# Altium schematic sheet Sheet1.SchDoc
size A4
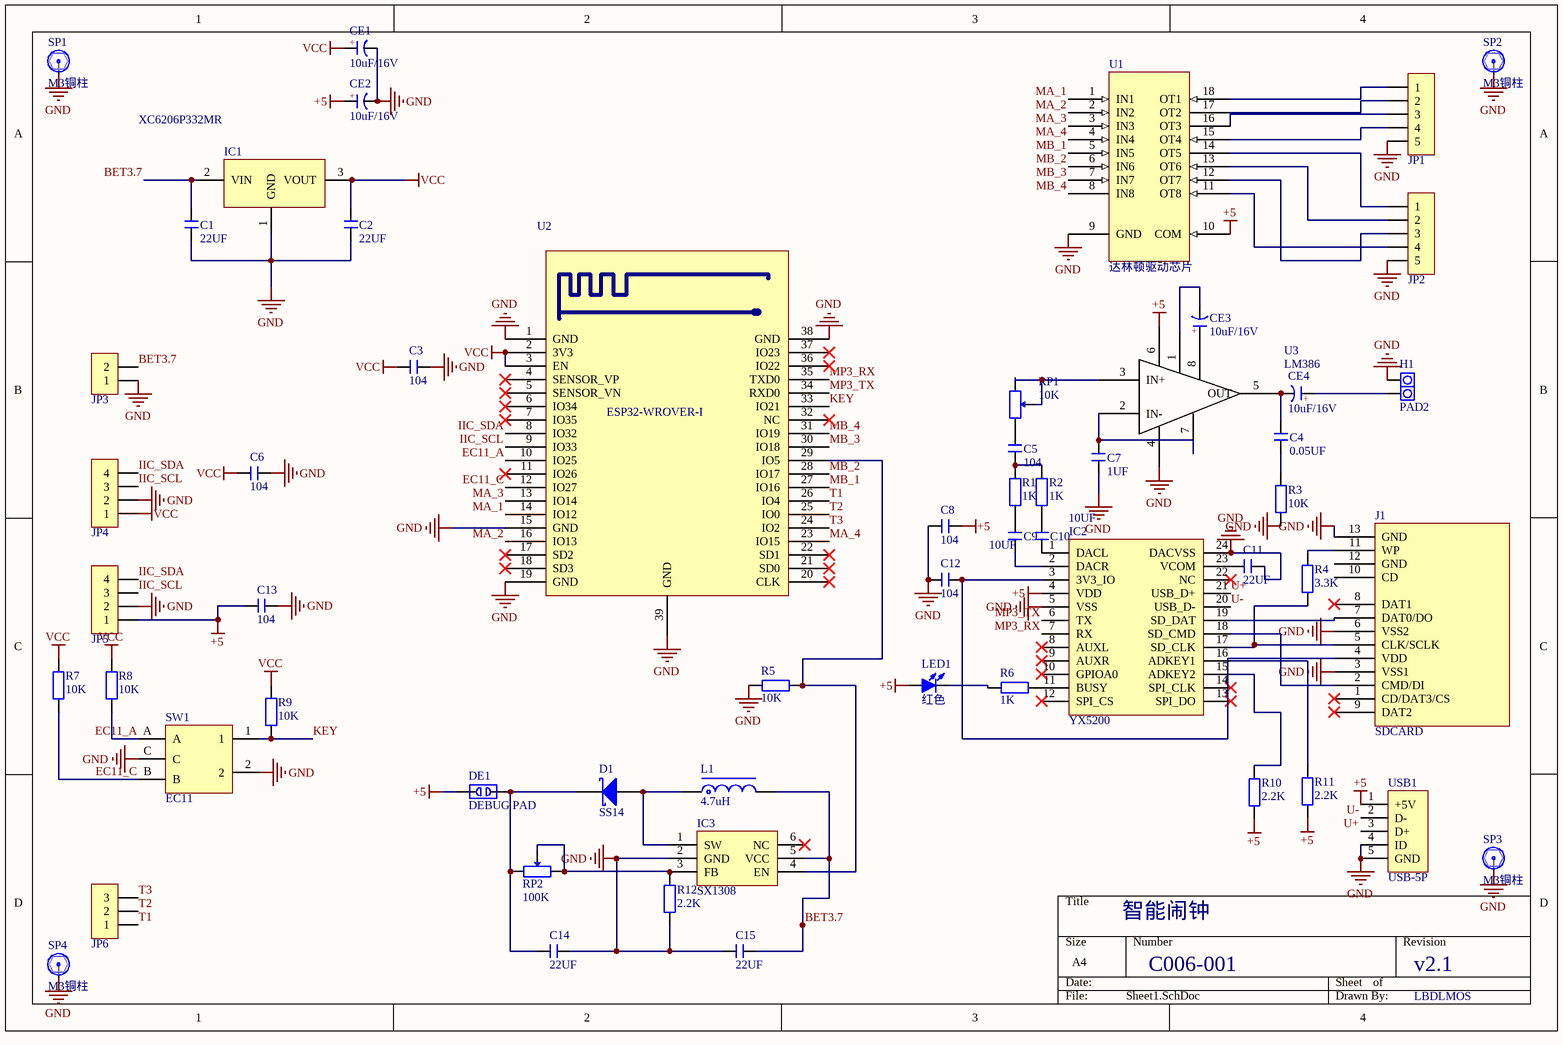
[diagram p0: Sheet1.SchDoc]

## Parts
C1  22UF  [C 0603_L]
C2  22UF  [C 0603_L]
C3  104  [C 0805_L]
C4  0.05UF  [C 0603_L]
C5  104  [C 0805_L]
C6  104  [C 0805_L]
C7  1UF  [C 0603_L]
C8  104  [C 0603_L]
C9  10UF  [C 0603_L]
C10  10UF  [C 0603_L]
C11  22UF  [C 0805_L]
C12  104  [C 0603_L]
C13  104  [C 0805_L]
C14  22UF  [C 0603_L]
C15  22UF  [C 0603_L]
CE1  10uF/16V  [CAP 1.5*4*8]
CE2  10uF/16V  [CAP 1.5*4*8]
CE3  10uF/16V  [CAP 1.5*4*8]
CE4  10uF/16V  [CAP 1.5*4*8]
D1  SS14  [SMA]
DE1  DEBUG PAD  [DEBUG_A]
H1  PAD2  [PAD2-5.08]
IC1  XC6206P332MR  [SOT-23]
IC2  YX5200  [SSOP24_N]
IC3  SX1308  [SOT23-6N]
J1  SDCARD  [SDCARD_B]
JP1  HDR-1X5  [HDR2.54-LI-5P]  (value not drawn)
JP2  HDR-1X5  [HDR2.54-LI-5P]  (value not drawn)
JP3  HDR-1X2  [HDR2.54-LI-2P]  (value not drawn)
JP4  HDR-1X4  [XH2.54-WI-4P]  (value not drawn)
JP5  HDR-1X4  [XH2.54-WI-4P]  (value not drawn)
JP6  HDR-1X3  [XH2.54-WI-3P]  (value not drawn)
L1  4.7uH  [CDRH73]
LED1  红色  [LED 0603B]
R1  1K  [R 0603_L]
R2  1K  [R 0603_L]
R3  10K  [R 0603_L]
R4  3.3K  [R 0603_L]
R5  10K  [R 0805_L]
R6  1K  [R 0603_L]
R7  10K  [R 0603_L]
R8  10K  [R 0603_L]
R9  10K  [R 0603_L]
R10  2.2K  [R 0603_L]
R11  2.2K  [R 0603_L]
R12  2.2K  [R 0603_L]
RP1  10K  [3296W]
RP2  100K  [3296W]
SP1  M3铜柱  [M3x4+6_L]
SP2  M3铜柱  [M3x4+6_L]
SP3  M3铜柱  [M3x4+6_L]
SP4  M3铜柱  [M3x4+6_L]
SW1  EC11  [EC11-B]
U1  达林顿驱动芯片  [DIP18-300]
U2  ESP32-WROVER-I  [ESP32-WROVER-I]
U3  LM386  [DIP-8]
USB1  USB-5P  [USB-MICRO_A]

## Nets
+5: C8.2 C13.1 CE2.1(A) DE1.1 IC2.4(VDD) JP5.1 LED1.1(A) R10.1 R11.1 U1.10(COM) U3.6 USB1.1(+5V)
GND: C1.1 C2.1 C3.2 C6.2 C7.1 C8.1 C11.2 C12.1 C13.2 C14.2 C15.1 CE1.2(K) CE2.2(K) H1.1 IC1.1(GND) IC2.5(VSS) IC2.24(DACVSS) IC3.2(GND) J1.3(VSS1) J1.6(VSS2) J1.13(GND) JP1.5 JP2.5 JP3.1 JP4.2 JP5.2 R3.1 R5.1 R12.1 SP1.1 SP2.1 SP3.1 SP4.1 SW1.2 SW1.C U1.9(GND) U2.1(GND) U2.15(GND) U2.19(GND) U2.38(GND) U2.39(GND) U3.4 USB1.4(ID) USB1.5(GND)
VCC: C2.2 C3.1 C6.1 CE1.1(A) IC1.3(VOUT) JP4.1 R7.2 R8.2 R9.2 U2.2(3V3) U2.3(EN)
BET3.7: C1.2 C15.2 IC1.2(VIN) IC3.5(VCC) JP3.2 L1.2
EC11_A: R8.1 SW1.A U2.10(IO25)
EC11_C: R7.1 SW1.B U2.12(IO27)
IIC_SCL: JP4.3 JP5.3 U2.9(IO33)
IIC_SDA: JP4.4 JP5.4 U2.8(IO32)
KEY: R9.1 SW1.1 U2.33(IO21)
MA_1: U1.1(IN1) U2.14(IO12)
MA_2: U1.2(IN2) U2.16(IO13)
MA_3: U1.3(IN3) U2.13(IO14)
MA_4: U1.4(IN4) U2.23(IO15)
MB_1: U1.5(IN5) U2.27(IO16)
MB_2: U1.6(IN6) U2.28(IO17)
MB_3: U1.7(IN7) U2.30(IO18)
MB_4: U1.8(IN8) U2.31(IO19)
MP3_RX: IC2.7(RX) U2.35(TXD0)
MP3_TX: IC2.6(TX) U2.34(RXD0)
T1: JP6.1 U2.26(IO4)
T2: JP6.2 U2.25(IO0)
T3: JP6.3 U2.24(IO2)
U+: IC2.21(USB_D+) USB1.3(D+)
U-: IC2.20(USB_D-) USB1.2(D-)
NetC4_1: C4.1 R3.2
NetC4_2: C4.2 CE4.2(K) U3.5(OUT)
NetC5_1: C5.1 R1.2 R2.2
NetC5_2: C5.2 RP1.3
NetC7_2: C7.2 U3.2(IN-) U3.7
NetC9_1: C9.1 IC2.2(DACR)
NetC9_2: C9.2 R1.1
NetC10_1: C10.1 IC2.1(DACL)
NetC10_2: C10.2 R2.1
NetC11_1: C11.1 IC2.23(VCOM)
NetC12_2: C12.2 IC2.3(3V3_IO) J1.4(VDD)
NetC14_1: C14.1 D1.2(K) DE1.2 RP2.1
NetCE3_1: CE3.1(A) U3.8
NetCE3_2: CE3.2(K) U3.1
NetCE4_1: CE4.1(A) H1.2
NetD1_1: D1.1(A) IC3.1(SW) L1.1
NetIC2_11: IC2.11(BUSY) R6.2
NetIC2_15: IC2.15(ADKEY2) R10.2
NetIC2_16: IC2.16(ADKEY1) R11.2
NetIC2_17: IC2.17(SD_CLK) J1.5(CLK/SCLK) R4.1
NetIC2_18: IC2.18(SD_CMD) J1.2(CMD/DI)
NetIC2_19: IC2.19(SD_DAT) J1.7(DAT0/DO)
NetIC3_3: IC3.3(FB) R12.2 RP2.2 RP2.3
NetIC3_4: IC3.4(EN) R5.2 U2.29(IO5)
NetJ1_11: J1.11(WP) R4.2
NetJP1_1: JP1.1 U1.18(OT1)
NetJP1_2: JP1.2 U1.17(OT2)
NetJP1_3: JP1.3 U1.16(OT3)
NetJP1_4: JP1.4 U1.15(OT4)
NetJP2_1: JP2.1 U1.14(OT5)
NetJP2_2: JP2.2 U1.13(OT6)
NetJP2_3: JP2.3 U1.12(OT7)
NetJP2_4: JP2.4 U1.11(OT8)
NetLED1_2: LED1.2(K) R6.1
NetRP1_1: RP1.1 RP1.2 U3.3(IN+)

Not connected (* = marked no-connect by the designer): IC2 8(AUXL)* 9(AUXR)* 10(GPIOA0)* 12(SPI_CS)* 13(SPI_DO)* 14(SPI_CLK)* 22(NC)*; IC3 6(NC)*; J1 1(CD/DAT3/CS)* 8(DAT1)* 9(DAT2)* 10(CD) 12(GND); U2 4(SENSOR_VP)* 5(SENSOR_VN)* 6(IO34)* 7(IO35)* 11(IO26)* 17(SD2)* 18(SD3)* 20(CLK)* 21(SD0)* 22(SD1)* 32(NC)* 36(IO22)* 37(IO23)*

## Notes on the sheet
- 智能闹钟
- C006-001
- v2.1
- LBDLMOS
- (in symbol CE) +

## Library data of the parts
C1-C15 = C: 贴片电容; BOM名称: 无极性贴片电容; 淘宝ID: 封装库来自淘宝 ID：黄晶宝石; 联系售后，技术支持: https://shop463601444.taobao.com; 唯一出售店铺网址: https://shop463601444.taobao.com
CE1-CE4 = CE: 直插电解电容; 淘宝ID: 封装库来自淘宝 ID：黄晶宝石; BOM名称: 直插电解电容; 联系售后: https://shop463601444.taobao.com
D1 = SS14: 肖特基二极管; 属性: 40V/1A; BOM名称: 肖特基二极管; 封装库来自淘宝 ID：黄晶宝石: https://shop463601444.taobao.com
DE1 = DEBUG: 调试断点焊盘; 版权归属: 封装库来自淘宝 ID：黄晶宝石; BOM名称: 调试断点焊盘; 学习资源: https://shop463601444.taobao.com
H1 = PAD2: 引线焊盘; 版权归属: 封装库来自淘宝 ID：黄晶宝石; BOM名称: 引线焊盘; 学习资源: https://shop463601444.taobao.com
IC2 = YX5200: MP3解码芯片; 版权归属: 封装库来自淘宝 ID：黄晶宝石; BOM名称: MP3解码芯片; 唯一出售店铺网址: https://shop463601444.taobao.com
IC3 = SX1308: 可调升压芯片; 版权归属: 封装库来自淘宝 ID：黄晶宝石; BOM名称: 可调升压芯片; 学习资源: www.ooocke.com
J1 = SDCARD: SD卡自弹
JP1 JP2 = Header 5: 5P接插件; 版权归属: 封装库来自淘宝 ID：黄晶宝石; BOM名称: 5P接插件; 学习资源: https://shop463601444.taobao.com
JP3 = Header 2: 2P接插件; 版权归属: 封装库来自淘宝 ID：黄晶宝石; BOM名称: 2P接插件; 联系售后: https://shop463601444.taobao.com
JP4 JP5 = Header 4: 4P接插件; 版权归属: 封装库来自淘宝 ID：黄晶宝石; BOM名称: 4P接插件; 学习资源: https://shop463601444.taobao.com
JP6 = Header 3: 3P接插件; 版权归属: 封装库来自淘宝 ID：黄晶宝石; BOM名称: 3P接插件; 学习资源: https://shop463601444.taobao.com
L1 = L-CDRH: 功率屏蔽电感; 版权归属: 封装库来自淘宝 ID：黄晶宝石; BOM名称: 功率屏蔽电感; 联系售后: https://shop463601444.taobao.com
LED1 = LED-SMD: 贴片LED; 版权归属: 封装库来自淘宝 ID：黄晶宝石; BOM名称: 贴片LED; 学习资源: https://shop463601444.taobao.com
R1-R12 = R: 贴片电阻; 版权归属: 来自淘宝 ID：黄晶宝石; 封装库来自淘宝卖家 ID：黄晶宝石: 其他店铺购入均为盗版，不享受售后技术支持服务，请立即申请退款; BOM名称: 贴片电阻; 联系售后: https://shop463601444.taobao.com
RP1 RP2 = RP: 单联电位器; BOM名称: 插件电位器; 版权归属: 封装库来自淘宝 ID：黄晶宝石; 联系售后: https://shop463601444.taobao.com
SP1-SP4 = 铜柱加头小焊盘: 铜柱; 版权归属: 封装库来自淘宝 ID：黄晶宝石; BOM名称: 铜柱; 学习资源: https://shop463601444.taobao.com
SW1 = EC11: 数字开关编码器; BOM名称: 数字编码开关; 版权归属: 封装库来自淘宝 ID：黄晶宝石; 封装库来自淘宝卖家 ID：黄晶宝石: 其他店铺购入均为盗版，不享受售后技术支持服务，请立即申请退款; 技术支持，联系售后: https://shop463601444.taobao.com
U1 = ULN2803: 封装库来自淘宝 ID：黄晶宝石: https://shop463601444.taobao.com
U3 = LM386: 音频放大器
USB1 = USB-5P: 微型USB母座; BOM名称: 微型USB母座; 学习资源: https://shop463601444.taobao.com